# Altium schematic sheet TTL USB.SchDoc
size A4
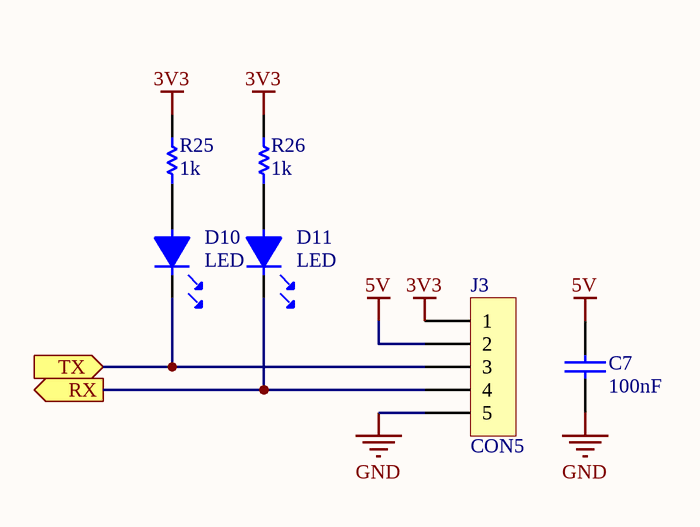
[diagram p0: TTL USB.SchDoc]

## Parts
C7  100nF  [0805]
D10  LED  [LED0805]
D11  LED  [LED0805]
J3  CON5  [SIP5]
R25  1k  [0805]
R26  1k  [0805]

## Ports
RX (out), TX (in)

## Nets
3V3: J3.1 R25.2 R26.2
5V: C7.1 J3.2
GND: C7.2 J3.5
RX: D11.2 J3.4 ; port RX
TX: D10.2 J3.3 ; port TX
NetD10_1: D10.1 R25.1
NetD11_1: D11.1 R26.1

## Library data of the parts
C7 = CAP
R25 R26 = RES